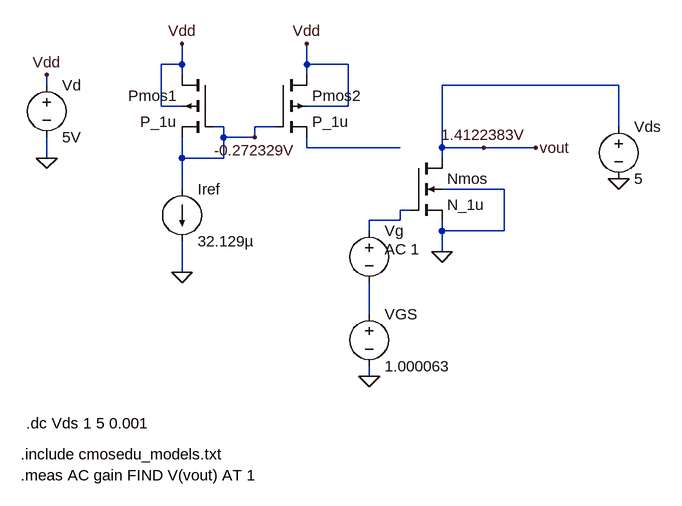
[diagram p0: schematic ex5pt4.asc]
ex5pt4.asc, the LTspice schematic file:
Version 4
SHEET 1 880 680
WIRE -1968 -1008 -1968 -1040
WIRE -1968 -1008 -2000 -1008
WIRE -1776 -1008 -1776 -1040
WIRE -1712 -1008 -1776 -1008
WIRE -1968 -992 -1968 -1008
WIRE -1776 -992 -1776 -1008
WIRE -2176 -976 -2176 -992
WIRE -1296 -976 -1568 -976
WIRE -2000 -944 -2000 -1008
WIRE -1968 -944 -2000 -944
WIRE -1712 -944 -1712 -1008
WIRE -1712 -944 -1776 -944
WIRE -1904 -912 -1920 -912
WIRE -1824 -912 -1856 -912
WIRE -1296 -912 -1296 -976
WIRE -1904 -896 -1904 -912
WIRE -1856 -896 -1856 -912
WIRE -1856 -896 -1904 -896
WIRE -1776 -880 -1776 -896
WIRE -1632 -880 -1776 -880
WIRE -1568 -880 -1568 -976
WIRE -1504 -880 -1568 -880
WIRE -1424 -880 -1504 -880
WIRE -2176 -864 -2176 -896
WIRE -1968 -864 -1968 -896
WIRE -1904 -864 -1904 -896
WIRE -1904 -864 -1968 -864
WIRE -1568 -864 -1568 -880
WIRE -1968 -816 -1968 -864
WIRE -1472 -816 -1568 -816
WIRE -1616 -784 -1632 -784
WIRE -1632 -768 -1632 -784
WIRE -1632 -768 -1680 -768
WIRE -1680 -752 -1680 -768
WIRE -1568 -752 -1568 -768
WIRE -1472 -752 -1472 -816
WIRE -1472 -752 -1568 -752
WIRE -1568 -720 -1568 -752
WIRE -1968 -688 -1968 -736
WIRE -1680 -624 -1680 -672
WIRE -1680 -528 -1680 -544
FLAG -2176 -864 0
FLAG -2176 -992 Vdd
FLAG -1968 -1040 Vdd
FLAG -1776 -1040 Vdd
FLAG -1968 -688 0
FLAG -1568 -720 0
FLAG -1424 -880 vout
FLAG -1680 -528 0
FLAG -1504 -880 1.4122383V
FLAG -1856 -896 -0.272329V
FLAG -1296 -832 0
SYMBOL voltage -2176 -992 R0
SYMATTR InstName Vd
SYMATTR Value 5V
SYMBOL pmos4 -1920 -992 M0
SYMATTR InstName Pmos1
SYMATTR Value P_1u
SYMATTR Value2 l=19.995640u w=3.000000u
SYMBOL pmos4 -1824 -992 R0
SYMATTR InstName Pmos2
SYMATTR Value P_1u
SYMATTR Value2 l=19.995640u w=3.000000u
SYMBOL current -1968 -816 R0
WINDOW 123 0 0 Left 2
WINDOW 39 0 0 Left 2
SYMATTR InstName Iref
SYMATTR Value 32.129µ
SYMBOL nmos4 -1616 -864 R0
SYMATTR InstName Nmos
SYMATTR Value N_1u
SYMATTR Value2 l=1.500000u w=17.501335u
SYMBOL voltage -1680 -640 R0
WINDOW 123 0 0 Left 2
WINDOW 39 0 0 Left 2
SYMATTR InstName VGS
SYMATTR Value 1.000063
SYMBOL voltage -1680 -768 R0
WINDOW 123 24 44 Left 2
WINDOW 39 0 0 Left 2
SYMATTR Value2 AC 1
SYMATTR InstName Vg
SYMATTR Value ""
SYMBOL voltage -1296 -928 R0
WINDOW 123 0 0 Left 2
WINDOW 39 0 0 Left 2
SYMATTR InstName Vds
SYMATTR Value 5
TEXT -2208 -456 Left 2 !.dc Vds 1 5 0.001
TEXT -2216 -408 Left 2 !.include cmosedu_models.txt
TEXT -2216 -376 Left 2 !.meas AC gain FIND V(vout) AT 1

The netlist it stands for:
* ex5pt4.asc
Vd Vdd 0 5V
M§Pmos1 Vdd -0.272329V -0.272329V Vdd P_1u l=19.995640u w=3.000000u
M§Pmos2 Vdd -0.272329V N001 Vdd P_1u l=19.995640u w=3.000000u
Iref -0.272329V 0 32.129µ
M§Nmos 1.4122383V N002 0 0 N_1u l=1.500000u w=17.501335u
VGS N003 0 1.000063
Vg N002 N003 AC 1
Vds 1.4122383V 0 5
.model NMOS NMOS
.model PMOS PMOS
.lib standard.mos
.dc Vds 1 5 0.001
.include cmosedu_models.txt
.meas AC gain FIND V(vout) AT 1
.backanno
.end